# EAGLE board cblockyeeshok (EAGLE 6.6.0), part 1 of 2
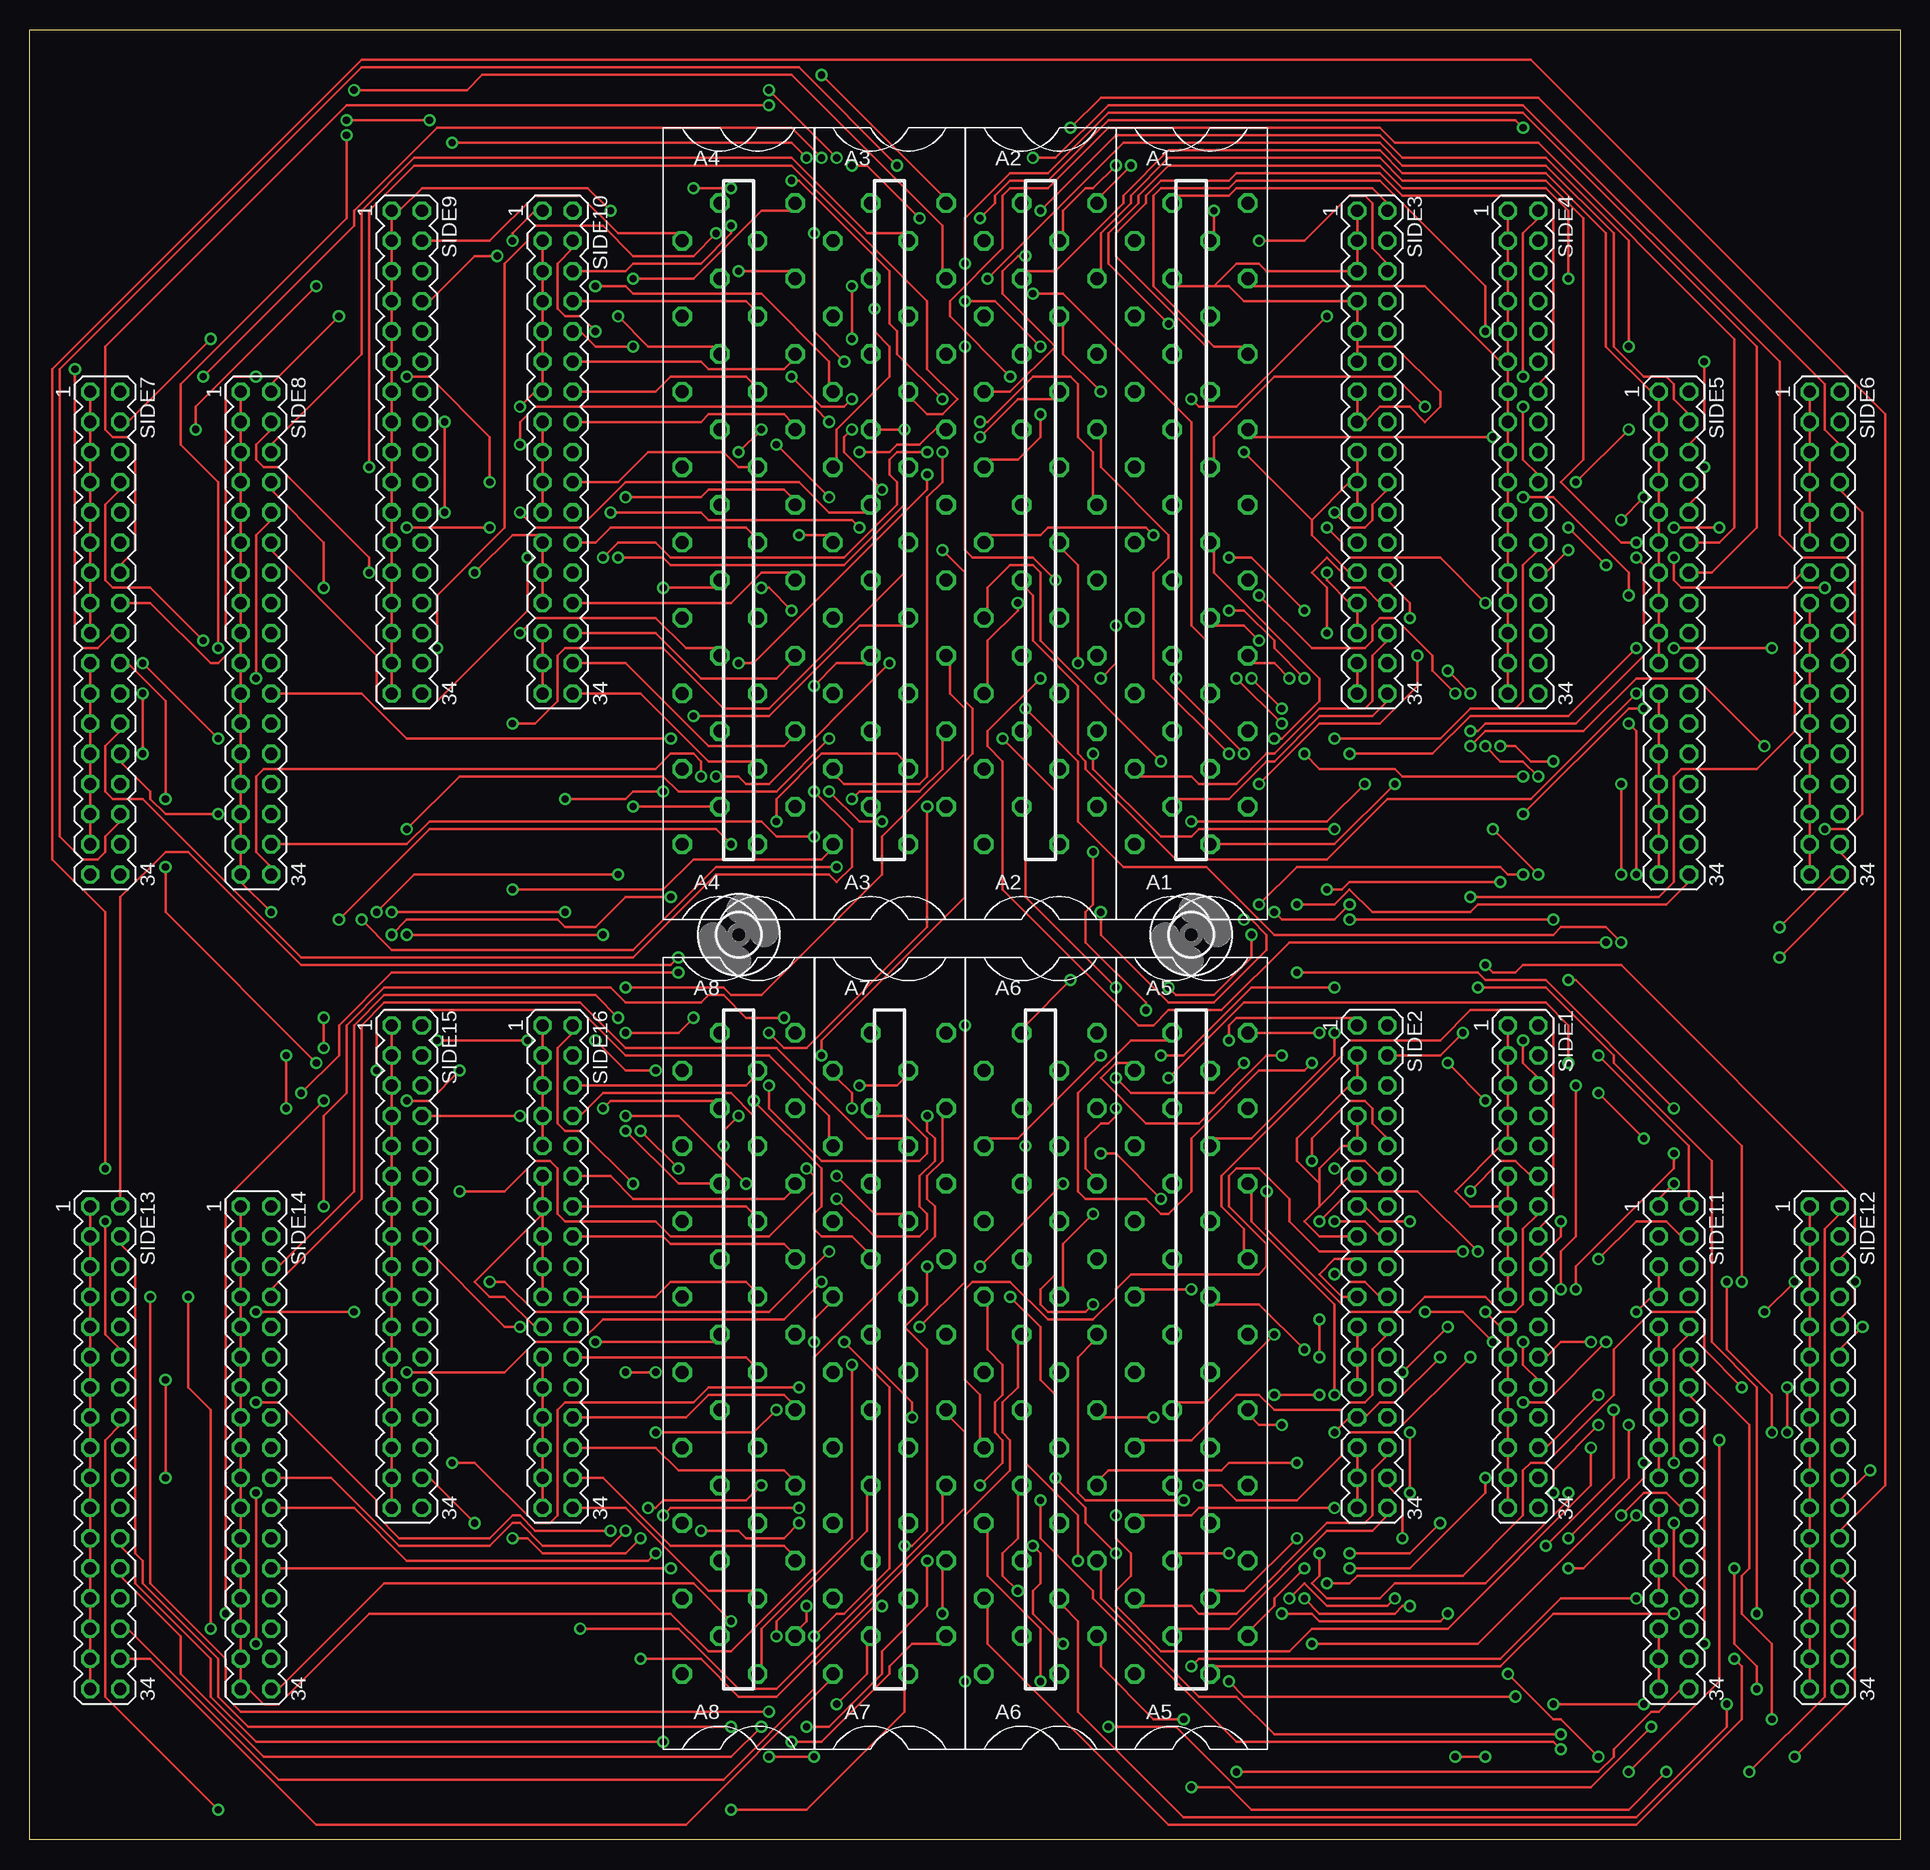
[diagram p1: board, top side]
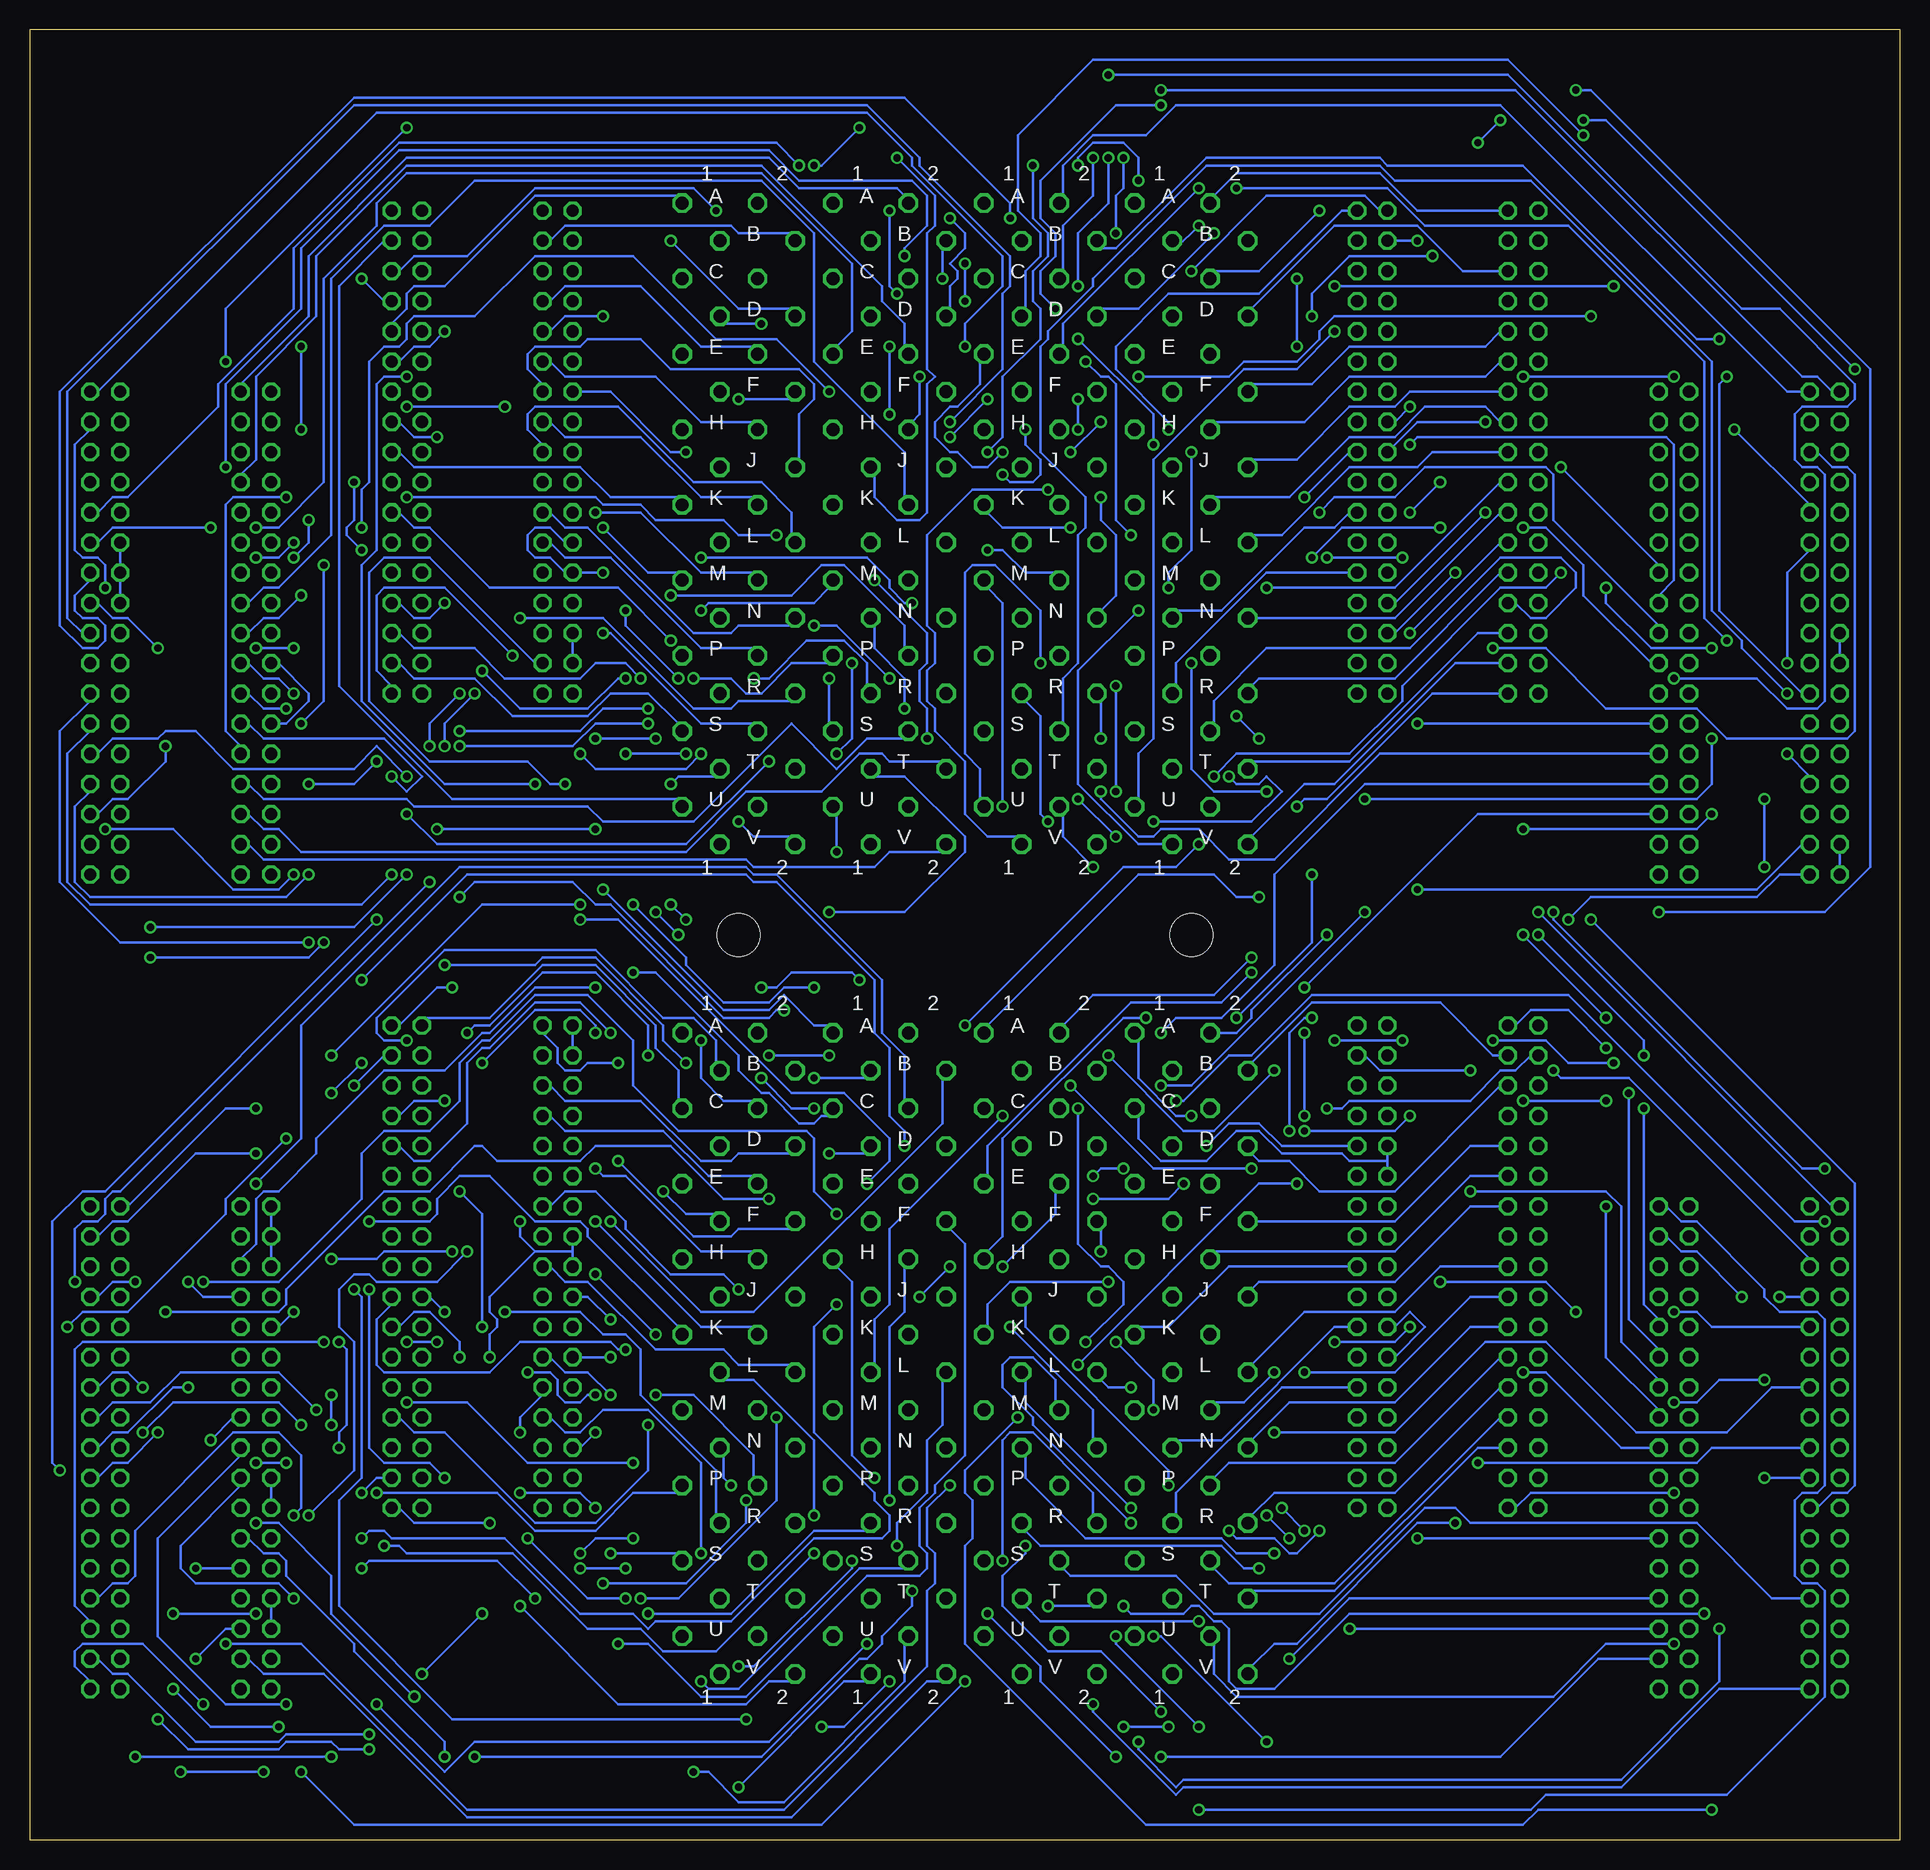
[diagram p2: board, bottom side, seen from below]

Size 157.48 x 152.4 mm. Coordinates in mm from the lower left corner, seen from the top.
Outline: 157.48,0 0,0 0,152.4 157.48,152.4 157.48,0
Copper layers (1*16): Top 0.035mm / dielectric 1.5mm / Bottom 0.035mm
Design rules "olimex8mil": minimum track width 8mil, minimum drill 24mil, track to track 8mil, track to pad 8mil, pad to pad 8mil, via to via 8mil, smd to smd 8mil, copper to edge 40mil, drill to drill 10mil, minimum pad ring 10mil, minimum via ring 8mil, stop-mask expansion 0mil, vias tented up to drill 0mil, thermal gap 10mil
Net classes: 1 Power: width 0.305 mm, clearance 0.305 mm

## Footprints (pad centres in the part's own frame; a part is rotated, then mirrored left to right if it is on the bottom)
H807 = drill 1.092 octagon: A1 4.763,28.575; A2 -1.587,28.575; B1 1.587,25.4; B2 -4.763,25.4; C1 4.763,22.225; C2 -1.587,22.225; D1 1.587,19.05; D2 -4.763,19.05; E1 4.763,15.875; E2 -1.587,15.875; F1 1.587,12.7; F2 -4.763,12.7; H1 4.763,9.525; H2 -1.587,9.525; J1 1.587,6.35; J2 -4.763,6.35; K1 4.763,3.175; K2 -1.587,3.175; L1 1.587,0; L2 -4.763,0; M1 4.763,-3.175; M2 -1.587,-3.175; N1 1.587,-6.35; N2 -4.763,-6.35; P1 4.763,-9.525; P2 -1.587,-9.525; R1 1.587,-12.7; R2 -4.763,-12.7; S1 4.763,-15.875; S2 -1.587,-15.875; T1 1.587,-19.05; T2 -4.763,-19.05; U1 4.763,-22.225; U2 -1.587,-22.225; V1 1.587,-25.4; V2 -4.763,-25.4
MA17-2 = drill 1.016 octagon: 1 -20.32,-1.27; 2 -20.32,1.27; 3 -17.78,-1.27; 4 -17.78,1.27; 5 -15.24,-1.27; 6 -15.24,1.27; 7 -12.7,-1.27; 8 -12.7,1.27; 9 -10.16,-1.27; 10 -10.16,1.27; 11 -7.62,-1.27; 12 -7.62,1.27; 13 -5.08,-1.27; 14 -5.08,1.27; 15 -2.54,-1.27; 16 -2.54,1.27; 17 0,-1.27; 18 0,1.27; 19 2.54,-1.27; 20 2.54,1.27; 21 5.08,-1.27; 22 5.08,1.27; 23 7.62,-1.27; 24 7.62,1.27; 25 10.16,-1.27; 26 10.16,1.27; 27 12.7,-1.27; 28 12.7,1.27; 29 15.24,-1.27; 30 15.24,1.27; 31 17.78,-1.27; 32 17.78,1.27; 33 20.32,-1.27; 34 20.32,1.27
3,6 = hole 3.6: 0,0

## Placement (x,y rotation side)
A1  [H807]  97.79,109.22 0 top
A2  [H807]  85.09,109.22 0 top
A3  [H807]  72.39,109.22 0 top
A4  [H807]  59.69,109.22 0 top
A5  [H807]  97.79,39.37 0 top
A6  [H807]  85.09,39.37 0 top
A7  [H807]  72.39,39.37 0 top
A8  [H807]  59.69,39.37 0 top
SIDE1  [MA17-2]  125.73,48.26 270 top
SIDE2  [MA17-2]  113.03,48.26 270 top
SIDE3  [MA17-2]  113.03,116.84 270 top
SIDE4  [MA17-2]  125.73,116.84 270 top
SIDE5  [MA17-2]  138.43,101.6 270 top
SIDE6  [MA17-2]  151.13,101.6 270 top
SIDE7  [MA17-2]  6.35,101.6 270 top
SIDE8  [MA17-2]  19.05,101.6 270 top
SIDE9  [MA17-2]  31.75,116.84 270 top
SIDE10  [MA17-2]  44.45,116.84 270 top
SIDE11  [MA17-2]  138.43,33.02 270 top
SIDE12  [MA17-2]  151.13,33.02 270 top
SIDE13  [MA17-2]  6.35,33.02 270 top
SIDE14  [MA17-2]  19.05,33.02 270 top
SIDE15  [MA17-2]  31.75,48.26 270 top
SIDE16  [MA17-2]  44.45,48.26 270 top
U$5  [3,6]  59.69,76.2 0 top
U$6  [3,6]  97.79,76.2 0 top

## Tracks (layer width: path | path; a pad name or v marks a point on that pad's centre or on a via)
N$1  (via drill 0.61)
  Top 0.203: SIDE2.3 111.76,65.41 111.76,64.14 SIDE2.5 111.12,63.5 106.68,59.05 106.68,57.15 108.58,55.24 | v100.97,67.31 100.97,68.58 101.6,69.22 111.76,69.22 SIDE2.1 | SIDE2.33 111.76,28.57 111.76,29.84 SIDE2.31 111.76,31.11 111.76,32.38 SIDE2.29 | v109.86,34.29 111.12,35.56 SIDE2.27 112.39,35.56 113.67,36.83 114.94,36.83 v118.75,40.64 | SIDE2.25 111.76,38.73 111.76,40.01 SIDE2.23 111.76,41.27 111.76,42.55 SIDE2.21 | SIDE2.7 111.76,60.33 111.76,59.05 SIDE2.9 111.12,58.42 110.49,58.42 108.58,56.52 108.58,55.24 | SIDE2.19 111.12,45.72 110.49,45.72 108.58,47.62 109.86,48.9 111.76,48.9 SIDE2.17 | v116.2,52.07 113.67,52.07 112.39,53.34 SIDE2.13 | 108.58,53.34 107.31,52.07 108.58,50.8 111.12,50.8 SIDE2.15 | 108.58,53.34 111.12,55.88 SIDE2.11 | 108.58,53.34 108.58,55.24 | v108.58,43.81 v108.58,40.64
  Bottom 0.203: v100.97,67.31 100.97,64.14 99.06,62.23 96.52,62.23 A5.C2 | SIDE2.3 111.76,66.67 111.76,67.94 SIDE2.1 | v109.86,34.29 111.12,33.02 SIDE2.29 | 111.76,49.53 111.76,48.9 SIDE2.17 | 111.76,49.53 111.76,50.16 SIDE2.15 | v116.2,52.07 116.2,50.8 114.94,49.53 | 114.94,49.53 111.76,49.53 | v108.58,40.64 111.12,40.64 SIDE2.23 | v108.58,43.81 110.49,45.72 111.12,45.72 SIDE2.19 | v118.75,40.64 118.75,42.55 118.11,43.18 118.11,43.81 118.75,44.45 118.75,45.72 114.94,49.53
N$2  (via drill 0.61)
  Top 0.203: v107.95,65.41 107.31,64.77 103.5,64.77 97.79,59.05 97.79,54.61 95.89,52.7 95.25,52.7 93.98,53.98 88.9,53.98 88.27,54.61 88.27,62.87 92.71,67.31 95.89,67.31 A5.A2
  Bottom 0.203: v107.95,65.41 110.49,65.41 111.12,64.77 112.39,64.77 113.03,65.41 113.03,66.67 114.3,67.94 SIDE2.2
N$3  (via drill 0.61)
  Top 0.203: v105.41,66.04 104.14,66.04 98.42,60.33 93.98,60.33 90.17,64.14 91.44,65.41 92.71,65.41 A5.B2 | v120.65,67.94 118.75,66.04 114.94,66.04 SIDE2.4
  Bottom 0.203: v105.41,66.04 105.41,68.58 109.86,73.03 114.3,73.03 118.75,68.58 120.02,68.58 v120.65,67.94
N$4
  Bottom 0.203: A5.D2 93.34,57.78 97.79,57.78 98.42,57.15 100.97,57.15 106.05,62.23 112.39,62.23 113.67,63.5 SIDE2.6
N$5
  Bottom 0.203: A5.E2 96.52,55.88 100.33,55.88 104.14,59.69 112.39,59.69 113.67,60.96 SIDE2.8
N$6  (via drill 0.61)
  Top 0.203: v107.95,57.15 107.95,59.05 111.12,62.23 112.39,62.23 113.03,61.59 113.03,60.33 114.3,59.05 SIDE2.10
  Bottom 0.203: v107.95,57.15 101.6,50.8 98.42,50.8 97.79,51.44 93.34,51.44 A5.F2
N$7  (via drill 0.61)
  Top 0.203: v109.86,56.52 110.49,56.52 111.12,57.15 112.39,57.15 113.67,55.88 SIDE2.12
  Bottom 0.203: v109.86,56.52 109.22,55.88 107.31,55.88 100.97,49.53 96.52,49.53 A5.H2
N$8  (via drill 0.61)
  Top 0.203: v97.79,46.35 93.34,46.35 A5.J2
  Bottom 0.203: v97.79,46.35 99.06,47.62 103.5,47.62 107.31,51.44 107.31,52.07 109.86,54.61 112.39,54.61 113.67,53.34 SIDE2.14
N$9  (via drill 0.61)
  Top 0.203: v109.86,52.07 112.39,52.07 113.67,50.8 SIDE2.16
  Bottom 0.203: v109.86,52.07 100.97,43.18 96.52,43.18 A5.K2
N$10
  Bottom 0.203: A5.L2 93.34,40.01 97.79,40.01 99.06,41.27 104.78,41.27 110.49,46.99 112.39,46.99 113.67,48.26 SIDE2.18
N$11  (via drill 0.61)
  Top 0.203: v104.78,42.55 99.06,36.83 96.52,36.83 A5.M2 | v109.86,47.62 110.49,47.62 111.12,46.99 112.39,46.99 113.67,45.72 SIDE2.20
  Bottom 0.203: v104.78,42.55 v109.86,47.62
N$12
  Top 0.203: A5.N2 93.34,33.66 97.79,33.66 101.6,37.47 103.5,37.47 104.78,36.2 110.49,36.2 111.12,36.83 112.39,36.83 113.03,37.47 113.03,41.27 114.3,42.55 SIDE2.22
N$13  (via drill 0.61)
  Top 0.203: v104.78,37.47 v108.58,37.47
  Bottom 0.203: v104.78,37.47 101.6,37.47 96.52,32.38 96.52,30.48 A5.P2 | v108.58,37.47 110.49,39.37 112.39,39.37 113.67,40.64 SIDE2.24
N$14  (via drill 0.61)
  Top 0.203: v109.86,27.94 98.42,27.94 97.79,27.3 93.34,27.3 A5.R2 | v116.2,29.21 v116.2,34.29
  Bottom 0.203: v109.86,27.94 111.12,29.21 v116.2,29.21 | v116.2,34.29 116.2,35.56 114.3,37.47 SIDE2.26
N$15  (via drill 0.61)
  Top 0.203: v100.97,24.13 96.52,24.13 A5.S2
  Bottom 0.203: v100.97,24.13 100.97,31.75 105.41,36.2 109.22,36.2 111.12,34.29 112.39,34.29 113.67,35.56 SIDE2.28
N$16
  Top 0.203: A5.T2 93.34,19.68 97.79,19.68 98.42,19.05 101.6,19.05 109.22,26.67 112.39,26.67 113.03,27.3 113.03,31.11 114.3,32.38 SIDE2.30
N$17
  Top 0.203: A5.U2 96.52,17.78 100.97,17.78 109.22,26.04 113.03,26.04 114.3,27.3 SIDE2.34
N$18  (via drill 0.61)
  Top 0.203: v116.2,19.68 115.57,19.68 114.94,19.05 108.58,19.05 v107.31,20.32 | v115.57,25.4 115.57,28.57 114.3,29.84 SIDE2.32
  Bottom 0.203: v116.2,19.68 107.95,11.43 97.16,11.43 95.25,13.34 93.34,13.34 A5.V2 | v107.31,20.32 110.49,20.32 v115.57,25.4
N$19  (via drill 0.61)
  Top 0.203: v108.58,67.94 102.87,67.94 A5.A1
  Bottom 0.203: v108.58,67.94 111.12,70.48 114.94,70.48 118.75,66.67 119.38,66.67 120.65,65.41 120.65,60.33 123.83,57.15 125.09,57.15 126.36,58.42 SIDE1.10
N$20  (via drill 0.61)
  Top 0.203: v125.73,67.31 125.73,65.41 127,64.14 SIDE1.6
  Bottom 0.203: v125.73,67.31 127.64,67.31 128.27,67.94 128.27,69.22 122.56,74.93 109.86,74.93 104.14,69.22 101.6,69.22 99.69,67.31 99.69,65.41 A5.B1
N$21  (via drill 0.61)
  Top 0.203: v109.86,67.94 109.86,66.04 102.87,59.05 99.69,59.05 A5.D1 | v119.38,65.41 v122.56,62.23
  Bottom 0.203: v109.86,67.94 109.86,68.58 111.12,69.85 114.94,69.85 v119.38,65.41 | v122.56,62.23 125.09,62.23 126.36,60.96 SIDE1.8
N$22  (via drill 0.61)
  Top 0.203: v109.86,37.47 109.86,45.09 102.87,52.07 102.87,54.61 A5.E1 | v115.57,39.37 v119.38,43.18 | v121.28,54.61 123.83,57.15 125.09,57.15 126.36,55.88 SIDE1.12
  Bottom 0.203: v109.86,37.47 110.49,37.47 111.12,36.83 112.39,36.83 113.03,37.47 113.03,38.73 113.67,39.37 v115.57,39.37 | v119.38,43.18 119.38,52.7 v121.28,54.61
N$23  (via drill 0.61)
  Top 0.203: v104.14,54.61 104.14,51.44 111.12,44.45 116.2,44.45 117.47,45.72 122.56,45.72 123.83,44.45 125.09,44.45 125.73,45.09 125.73,51.44 127,52.7 SIDE1.14
  Bottom 0.203: v104.14,54.61 102.23,52.7 99.69,52.7 A5.F1
N$24
  Top 0.203: A5.H1 102.23,49.53 102.23,51.44 100.33,53.34 100.33,55.88 110.49,66.04 110.49,66.67 111.12,67.31 118.75,67.31 121.28,69.85 127.64,69.85 128.27,69.22 128.27,52.7 127,51.44 SIDE1.16
N$25  (via drill 0.61)
  Top 0.203: v107.31,41.27 103.5,45.09 99.69,45.09 A5.J1
  Bottom 0.203: v107.31,41.27 107.95,41.27 108.58,41.91 116.2,41.91 118.75,39.37 127.64,39.37 128.27,40.01 128.27,43.81 127,45.09 SIDE1.20
N$26  (via drill 0.61)
  Top 0.203: v128.91,52.07 128.91,50.8 127,48.9 SIDE1.18
  Bottom 0.203: v128.91,52.07 123.83,52.07 123.19,52.7 123.19,53.98 121.28,55.88 118.75,55.88 114.94,52.07 111.12,52.07 110.49,51.44 110.49,50.8 102.87,43.18 A5.K1
N$27  (via drill 0.61)
  Top 0.203: v91.44,27.3 91.44,25.4 92.71,24.13 92.71,22.23 91.44,20.95 91.44,19.68 95.25,15.88 106.05,15.88 107.95,17.78 119.38,17.78 131.44,29.84 v131.44,33.02 | v131.44,41.91 128.91,41.91 127.64,40.64 SIDE1.24
  Bottom 0.203: v91.44,27.3 91.44,33.66 96.52,38.73 99.06,38.73 A5.L1 | v131.44,33.02 131.44,34.29 130.81,34.92 130.81,41.27 v131.44,41.91
N$28  (via drill 0.61)
  Top 0.203: v105.41,34.92 103.5,34.92 102.87,35.56 A5.M1
  Bottom 0.203: v105.41,34.92 105.41,31.11 109.86,26.67 114.94,26.67 122.56,34.29 125.09,34.29 126.36,35.56 SIDE1.28
N$29  (via drill 0.61)
  Top 0.203: v98.42,29.84 100.33,29.84 101.6,28.57 106.68,28.57 110.49,32.38 110.49,33.66 111.12,34.29 114.94,34.29 v121.28,40.64
  Bottom 0.203: v98.42,29.84 99.06,30.48 99.06,32.38 A5.N1 | v121.28,40.64 121.28,41.91 123.83,44.45 125.09,44.45 126.36,43.18 SIDE1.22
N$30  (via drill 0.61)
  Top 0.203: v128.27,29.21 128.27,31.11 v132.08,34.92 | v132.08,37.47 127.64,33.02 SIDE1.30
  Bottom 0.203: v128.27,29.21 118.11,29.21 114.94,26.04 109.86,26.04 106.68,29.21 102.87,29.21 A5.P1 | v132.08,34.92 v132.08,37.47
N$31  (via drill 0.61)
  Top 0.203: v117.47,44.45 120.65,44.45 v123.19,41.91 | v125.73,41.91 125.73,40.01 127,38.73 SIDE1.26
  Bottom 0.203: v117.47,44.45 111.12,44.45 109.22,42.55 107.31,42.55 106.05,41.27 106.05,37.47 99.69,31.11 99.69,27.3 A5.R1 | v123.19,41.91 v125.73,41.91
N$32  (via drill 0.61)
  Top 0.203: v108.58,24.13 108.58,22.23 107.95,21.59 109.22,20.32 113.67,20.32 114.94,21.59 122.56,21.59 129.54,28.57 v129.54,29.21
  Bottom 0.203: v108.58,24.13 102.87,24.13 A5.S1 | v129.54,29.21 128.27,30.48 127.64,30.48 SIDE1.32
N$33  (via drill 0.61)
  Top 0.203: v106.68,25.4 102.23,20.95 99.69,20.95 A5.T1 | v111.12,24.13 116.2,24.13 v118.75,26.67
  Bottom 0.203: v106.68,25.4 109.86,25.4 v111.12,24.13 | v118.75,26.67 125.09,26.67 126.36,27.94 SIDE1.34
N$34  (via drill 0.61)
  Top 0.203: v107.31,22.86 104.78,20.32 104.78,19.68 102.87,17.78 A5.U1 | v111.12,22.86 116.2,22.86 122.56,29.21 v122.56,30.48 | v128.91,46.35 128.91,49.53 130.18,50.8 v130.18,63.5
  Bottom 0.203: v107.31,22.86 v111.12,22.86 | v122.56,30.48 123.83,31.75 127.64,31.75 128.91,33.02 v128.91,46.35 | v130.18,63.5 127.64,66.04 SIDE1.4
N$35  (via drill 0.61)
  Top 0.203: v138.43,19.05 128.27,19.05 123.83,14.61 99.69,14.61 A5.V1 | v145.41,19.05 145.41,38.1 141.6,41.91 141.6,57.15 133.35,65.41 133.35,66.04 127.64,71.75 v121.92,71.75
  Bottom 0.203: v138.43,19.05 v145.41,19.05 | v121.92,71.75 123.19,71.75 126.36,68.58 SIDE1.2
N$36  (via drill 0.61)
  Top 0.203: SIDE1.33 124.46,28.57 124.46,29.84 SIDE1.31 124.46,31.11 124.46,32.38 SIDE1.29 124.46,33.66 124.46,34.92 SIDE1.27 124.46,36.2 124.46,37.47 SIDE1.25 124.46,38.73 124.46,40.01 SIDE1.23 124.46,41.27 124.46,42.55 SIDE1.21 123.83,43.18 v122.56,44.45 | SIDE1.19 124.46,46.35 124.46,47.62 SIDE1.17 124.46,48.9 124.46,50.16 SIDE1.15 124.46,51.44 124.46,52.7 SIDE1.13 | SIDE1.11 124.46,55.24 124.46,53.98 SIDE1.13 | SIDE1.1 124.46,67.94 124.46,66.67 SIDE1.3 124.46,65.41 124.46,64.14 SIDE1.5 124.46,62.87 124.46,61.59 SIDE1.7 124.46,60.33 124.46,59.05 SIDE1.9 123.83,58.42 120.02,54.61 121.28,53.34 123.83,53.34 SIDE1.13
  Bottom 0.203: A5.C1 102.87,62.23 102.87,64.77 104.78,66.67 104.78,68.58 109.86,73.66 114.3,73.66 118.75,69.22 124.46,69.22 SIDE1.1 | v122.56,44.45 123.83,45.72 SIDE1.19
N$37  (via drill 0.61)
  Top 0.203: SIDE3.33 111.76,97.16 111.76,98.42 SIDE3.31 | SIDE3.29 111.76,102.23 111.76,103.5 SIDE3.27 111.12,104.14 109.22,106.05 v109.22,106.68 | 107.95,111.12 107.95,109.86 111.12,106.68 SIDE3.25 | 107.95,111.12 111.12,114.3 SIDE3.19 | SIDE3.21 111.76,112.39 111.76,113.67 SIDE3.19 | SIDE3.17 111.76,116.2 111.76,114.94 SIDE3.19 | SIDE3.13 111.76,121.28 111.76,120.02 SIDE3.15 112.39,119.38 113.67,120.65 116.2,120.65 117.47,119.38 118.75,120.65 118.75,121.92 114.94,125.73 111.76,125.73 | 111.76,125.73 111.76,126.36 SIDE3.9 111.76,127.64 111.76,128.91 SIDE3.7 111.12,129.54 102.23,129.54 100.97,130.81 99.69,130.81 | 111.76,125.73 111.76,125.09 SIDE3.11 | SIDE3.1 111.76,136.53 111.76,135.25 SIDE3.3 111.76,133.99 111.76,132.72 SIDE3.5 111.12,132.08 104.14,132.08 103.5,132.72 101.6,132.72 99.69,130.81 | 99.69,130.81 96.52,130.81 A1.C2 | 107.95,111.12 v102.23,116.84
  Bottom 0.203: SIDE3.29 111.76,100.97 111.76,99.69 SIDE3.31 | SIDE3.23 112.39,109.22 113.67,110.49 114.94,110.49 115.57,109.86 115.57,108.58 114.94,107.95 113.67,107.95 112.39,106.68 SIDE3.25 111.12,106.68 v109.22,106.68 | v102.23,116.84 103.5,116.84 108.58,121.92 111.12,121.92 SIDE3.13
N$38
  Top 0.203: SIDE3.2 114.3,137.79 113.03,139.06 101.6,139.06 100.97,138.43 96.52,138.43 A1.A2
N$39
  Bottom 0.203: A1.B2 93.34,135.25 97.79,135.25 98.42,135.89 112.39,135.89 113.67,134.62 SIDE3.4
N$40  (via drill 0.61)
  Top 0.203: v103.5,134.62 107.31,134.62 111.12,138.43 112.39,138.43 113.03,137.79 113.03,133.99 114.3,132.72 SIDE3.6
  Bottom 0.203: v103.5,134.62 97.79,128.91 93.34,128.91 A1.D2
N$41
  Bottom 0.203: A1.E2 96.52,125.73 100.97,125.73 106.05,130.81 112.39,130.81 113.67,129.54 SIDE3.8
N$42  (via drill 0.61)
  Top 0.203: v97.79,121.28 98.42,120.65 101.6,120.65 v109.22,128.27
  Bottom 0.203: v97.79,121.28 93.34,121.28 A1.F2 | v109.22,128.27 112.39,128.27 113.67,127 SIDE3.10
N$43
  Bottom 0.203: A1.H2 96.52,119.38 100.97,119.38 104.78,123.19 112.39,123.19 113.67,124.46 SIDE3.12
N$44
  Bottom 0.203: A1.J2 92.71,116.2 92.71,120.02 91.44,121.28 91.44,122.56 92.71,123.83 103.5,123.83 106.05,126.36 110.49,126.36 111.12,125.73 114.94,125.73 115.57,125.09 115.57,123.83 114.3,122.56 SIDE3.14
N$45
  Bottom 0.203: A1.K2 96.52,113.03 100.97,113.03 106.05,118.11 112.39,118.11 113.67,119.38 SIDE3.16
N$46
  Bottom 0.203: A1.L2 93.34,109.86 93.34,111.76 95.89,114.3 101.6,114.3 107.95,120.65 114.94,120.65 115.57,120.02 115.57,118.75 114.3,117.47 SIDE3.18
N$47  (via drill 0.61)
  Top 0.203: v109.86,111.76 111.12,110.49 112.39,110.49 113.03,111.12 113.03,112.39 114.3,113.67 SIDE3.20
  Bottom 0.203: v109.86,111.76 106.05,111.76 100.97,106.68 96.52,106.68 A1.M2
N$48
  Bottom 0.203: A1.N2 93.34,102.23 97.79,102.23 98.42,101.6 101.6,101.6 110.49,110.49 112.39,110.49 113.67,111.76 SIDE3.22
N$49
  Bottom 0.203: A1.P2 96.52,100.33 100.97,100.33 108.58,107.95 112.39,107.95 113.67,109.22 SIDE3.24
N$50  (via drill 0.61)
  Top 0.203: v116.2,102.87 116.2,104.14 114.3,106.05 SIDE3.26
  Bottom 0.203: v116.2,102.87 109.22,102.87 101.6,95.25 98.42,95.25 97.79,95.89 93.34,95.89 A1.R2
N$51  (via drill 0.61)
  Top 0.203: v109.22,101.6 109.22,105.41 107.95,106.68 109.22,107.95 110.49,106.68 110.49,106.05 111.12,105.41 112.39,105.41 113.67,104.14 SIDE3.28
  Bottom 0.203: v109.22,101.6 108.58,101.6 100.97,93.98 96.52,93.98 A1.S2
N$52
  Top 0.203: A1.T2 93.34,89.53 97.79,89.53 98.42,88.9 101.6,88.9 104.14,91.44 104.78,91.44 108.58,95.25 112.39,95.25 113.03,95.89 113.03,99.69 114.3,100.97 SIDE3.30
N$53
  Top 0.203: A1.U2 96.52,87.63 100.97,87.63 104.14,90.81 104.78,90.81 108.58,94.61 113.03,94.61 114.3,95.89 SIDE3.34
N$54  (via drill 0.61)
  Top 0.203: v97.79,85.72 109.22,85.72 v112.39,88.9
  Bottom 0.203: v97.79,85.72 96.52,84.45 93.34,84.45 A1.V2 | v112.39,88.9 113.67,88.9 115.57,90.81 123.83,90.81 128.91,95.89 128.91,106.68 127.64,107.95 123.83,107.95 114.94,99.06 SIDE3.32
N$55
  Bottom 0.203: SIDE4.10 127,127.64 125.73,128.91 125.73,130.18 125.09,130.81 122.56,130.81 114.94,138.43 102.87,138.43 A1.A1
N$56  (via drill 0.61)
  Top 0.203: v99.69,137.16 99.69,135.25 A1.B1
  Bottom 0.203: v99.69,137.16 101.6,139.06 114.94,139.06 120.65,133.35 125.09,133.35 126.36,132.08 SIDE4.6
N$57  (via drill 0.61)
  Top 0.203: v95.89,127.64 90.81,132.72 90.81,135.25 93.34,137.79 93.34,138.43 95.89,140.97 113.67,140.97 115.57,139.06 127.64,139.06 129.54,137.16 v129.54,131.44
  Bottom 0.203: v95.89,127.64 99.06,127.64 A1.D1 | v129.54,131.44 127.64,129.54 SIDE4.8
N$58  (via drill 0.61)
  Top 0.203: v122.56,127 122.56,130.81 113.67,139.7 101.6,139.7 100.97,139.06 95.25,139.06 94.61,138.43 94.61,130.81 99.69,125.73 102.23,125.73 A1.E1
  Bottom 0.203: v122.56,127 123.83,125.73 125.09,125.73 126.36,124.46 SIDE4.12
N$59
  Top 0.203: A1.F1 99.06,122.56 99.06,125.73 91.44,133.35 91.44,135.25 93.98,137.79 93.98,138.43 95.25,139.7 100.97,139.7 101.6,140.34 113.67,140.34 115.57,138.43 127.64,138.43 128.27,137.79 128.27,123.83 127,122.56 SIDE4.14
N$60  (via drill 0.61)
  Top 0.203: v123.19,118.11 102.87,118.11 A1.H1
  Bottom 0.203: v123.19,118.11 125.09,118.11 126.36,119.38 SIDE4.16
N$61  (via drill 0.61)
  Top 0.203: v125.73,120.65 125.73,116.2 127,114.94 SIDE4.20 | v117.47,120.65 114.94,123.19 104.78,123.19 99.69,118.11 99.69,116.2 A1.J1
  Bottom 0.203: v117.47,120.65 v125.73,120.65
N$62
  Bottom 0.203: A1.K1 102.87,113.03 108.58,113.03 111.12,115.57 125.09,115.57 126.36,116.84 SIDE4.18
N$63  (via drill 0.61)
  Top 0.203: v104.78,92.71 105.41,92.71 108.58,95.89 108.58,97.79 99.69,106.68 99.69,108.58 A1.L1 | v109.86,92.71 118.75,92.71 121.28,95.25 125.09,95.25 125.73,95.89 125.73,107.31 127,108.58 SIDE4.24
  Bottom 0.203: v104.78,92.71 v109.86,92.71
N$64  (via drill 0.61)
  Top 0.203: v109.22,110.49 110.49,109.22 110.49,108.58 111.12,107.95 118.75,107.95 v122.56,104.14
  Bottom 0.203: v109.22,110.49 105.41,106.68 102.87,106.68 A1.M1 | v122.56,104.14 123.83,102.87 125.09,102.87 126.36,104.14 SIDE4.28
N$65  (via drill 0.61)
  Top 0.203: v103.5,100.97 102.23,102.23 99.69,102.23 A1.N1
  Bottom 0.203: v103.5,100.97 107.95,105.41 118.75,105.41 123.83,110.49 125.09,110.49 126.36,111.76 SIDE4.22
N$66  (via drill 0.61)
  Top 0.203: v106.05,97.79 104.78,99.06 102.87,99.06 A1.P1
  Bottom 0.203: v106.05,97.79 107.31,99.06 109.86,99.06 111.12,97.79 117.47,97.79 120.02,100.33 125.09,100.33 126.36,101.6 SIDE4.30
N$67  (via drill 0.61)
  Top 0.203: v84.45,130.18 87,130.18 97.79,119.38 97.79,102.23 99.06,100.97 99.06,97.16 A1.R1 | v85.09,137.16 91.44,143.51 113.67,143.51 115.57,141.6 127.64,141.6 134.62,134.62 v134.62,125.73 | v134.62,118.75 v130.18,114.3 | v129.54,108.58 127.64,106.68 SIDE4.26
  Bottom 0.203: v84.45,130.18 85.09,130.81 v85.09,137.16 | v134.62,125.73 v134.62,118.75 | v130.18,114.3 130.18,111.12 130.81,110.49 130.81,109.86 v129.54,108.58
N$68
  Bottom 0.203: A1.S1 102.87,93.98 105.41,96.52 108.58,96.52 110.49,94.61 116.84,94.61 120.02,97.79 125.09,97.79 126.36,99.06 SIDE4.32
N$69  (via drill 0.61)
  Top 0.203: v103.5,88.9 108.58,93.98 113.67,93.98 116.84,97.16 v116.84,99.69
  Bottom 0.203: v103.5,88.9 102.87,89.53 99.69,89.53 A1.T1 | v116.84,99.69 122.56,105.41 127.64,105.41 128.27,104.78 128.27,98.42 127,97.16 SIDE4.34
N$70
  Bottom 0.203: A1.U1 102.87,87.63 121.92,87.63 131.44,97.16 131.44,130.81 127.64,134.62 SIDE4.4
N$71  (via drill 0.61)
  Top 0.203: v114.94,88.9 109.86,83.82 99.69,83.82 A1.V1 | v125.73,123.19 125.73,135.25 127,136.53 SIDE4.2
  Bottom 0.203: v114.94,88.9 122.56,88.9 129.54,95.89 129.54,107.31 128.27,108.58 128.27,122.56 127.64,123.19 v125.73,123.19
N$72
  Top 0.203: SIDE4.33 124.46,97.16 124.46,98.42 SIDE4.31 124.46,99.69 124.46,100.97 SIDE4.29 124.46,102.23 124.46,103.5 SIDE4.27 124.46,104.78 124.46,106.05 SIDE4.25 124.46,107.31 124.46,108.58 SIDE4.23 124.46,109.86 124.46,111.12 SIDE4.21 124.46,112.39 124.46,113.67 SIDE4.19 124.46,114.94 124.46,116.2 SIDE4.17 124.46,117.47 124.46,118.75 SIDE4.15 124.46,120.02 124.46,121.28 SIDE4.13 124.46,122.56 124.46,123.83 SIDE4.11 | SIDE4.11 124.46,125.09 124.46,126.36 SIDE4.9 124.46,127.64 124.46,128.91 SIDE4.7 124.46,130.18 124.46,131.44 SIDE4.5 124.46,132.72 124.46,133.99 SIDE4.3 124.46,135.25 124.46,136.53 SIDE4.1 | A1.C1 102.87,130.81 117.47,130.81 123.83,124.46 SIDE4.11
N$73
  Top 0.203: SIDE5.33 137.16,81.92 137.16,83.19 SIDE5.31 137.16,84.45 137.16,85.72 SIDE5.29 137.16,87 137.16,88.27 SIDE5.27 137.16,89.53 137.16,90.81 SIDE5.25 137.16,92.08 137.16,93.34 SIDE5.23 137.16,94.61 137.16,95.89 SIDE5.21 | SIDE5.19 137.16,99.69 137.16,100.97 SIDE5.17 137.16,102.23 137.16,103.5 SIDE5.15 137.16,104.78 137.16,106.05 SIDE5.13 137.16,107.31 137.16,108.58 SIDE5.11 137.16,109.86 137.16,111.12 SIDE5.9 137.16,112.39 137.16,113.67 SIDE5.7 137.16,114.94 137.16,116.2 SIDE5.5 137.16,117.47 137.16,118.75 SIDE5.3 137.16,120.02 137.16,121.28 SIDE5.1 136.53,121.92 132.72,125.73 132.72,135.25 127.64,140.34 115.57,140.34 113.67,142.24 95.89,142.24 92.08,138.43 92.08,137.79 86.36,132.08 83.82,132.08 A2.C2
  Bottom 0.203: SIDE5.23 136.53,93.98 135.89,93.98 133.99,95.89 133.99,96.52 136.53,99.06 SIDE5.19
N$74
  Bottom 0.203: SIDE5.2 139.7,122.56 133.99,128.27 133.99,133.35 125.73,141.6 95.25,141.6 92.71,139.06 84.45,139.06 83.82,138.43 A2.A2
N$75  (via drill 0.61)
  Top 0.203: v80.64,131.44 92.08,142.88 113.67,142.88 115.57,140.97 127.64,140.97 133.35,135.25 133.35,125.73 135.89,123.19 137.79,123.19 138.43,122.56 138.43,121.28 139.7,120.02 SIDE5.4
  Bottom 0.203: v80.64,131.44 80.64,133.99 A2.B2
N$76  (via drill 0.61)
  Top 0.203: v80.01,136.53 81.28,137.79 81.28,138.43 82.55,139.7 85.72,139.7 90.81,144.78 125.09,144.78 v125.73,144.15 | v140.97,124.46 140.97,118.75 139.7,117.47 SIDE5.6
  Bottom 0.203: v80.01,136.53 78.74,135.25 78.74,133.99 80.01,132.72 79.38,132.08 79.38,131.44 80.01,130.81 80.01,128.91 A2.D2 | v125.73,144.15 140.97,128.91 v140.97,124.46
N$77
  Bottom 0.203: SIDE5.8 139.7,114.94 138.43,116.2 138.43,123.19 133.35,128.27 133.35,133.35 125.73,140.97 95.89,140.97 85.72,130.81 85.72,129.54 83.82,127.64 83.82,125.73 A2.E2
N$78  (via drill 0.61)
  Top 0.203: v140.97,115.57 140.97,113.67 139.7,112.39 SIDE5.10 | v83.82,133.35 83.19,133.35 81.92,132.08 81.92,130.18 86.36,125.73 82.55,121.92 80.64,121.92 A2.F2
  Bottom 0.203: v140.97,115.57 140.97,122.56 134.62,128.91 134.62,133.99 126.36,142.24 95.25,142.24 92.71,139.7 83.19,139.7 81.92,138.43 81.92,135.89 83.82,133.99 v83.82,133.35
N$79  (via drill 0.61)
  Top 0.203: v82.55,123.19 77.47,128.27 77.47,129.54 81.92,133.99 81.92,138.43 82.55,139.06 85.72,139.06 90.81,144.15 113.67,144.15 114.94,142.88 127,142.88 143.51,126.36 143.51,110.49 142.24,109.22 140.34,109.22 SIDE5.12
  Bottom 0.203: v82.55,123.19 82.55,120.02 83.19,119.38 A2.H2
N$80  (via drill 0.61)
  Top 0.203: v85.09,120.02 85.09,118.11 83.19,116.2 80.64,116.2 A2.J2 | v85.09,125.73 81.28,129.54 v78.74,129.54 | v78.74,132.72 78.74,136.53 82.55,140.34 85.72,140.34 90.81,145.41 125.73,145.41 145.41,125.73 145.41,110.49 141.6,106.68 140.34,106.68 SIDE5.14
  Bottom 0.203: v85.09,125.73 v85.09,120.02 | v78.74,132.72 v78.74,129.54
N$81
  Bottom 0.203: A2.K2 83.82,113.03 83.82,116.84 91.44,124.46 91.44,135.25 95.89,139.7 120.02,139.7 123.83,135.89 127.64,135.89 132.08,131.44 132.08,109.86 136.53,105.41 137.79,105.41 139.06,104.14 SIDE5.16
N$82  (via drill 0.61)
  Top 0.203: v94.61,109.86 93.98,110.49 85.72,110.49 85.09,109.86 80.64,109.86 A2.L2 | v125.73,113.03 128.27,113.03 134.62,106.68 v134.62,104.78
  Bottom 0.203: v94.61,109.86 97.79,109.86 99.06,111.12 104.78,111.12 106.05,112.39 109.22,112.39 109.86,113.03 v125.73,113.03 | v134.62,104.78 136.53,102.87 137.79,102.87 139.06,101.6 SIDE5.18
N$83  (via drill 0.61)
  Top 0.203: v135.25,96.52 126.36,87.63 114.3,87.63 109.22,82.55 96.52,82.55 88.9,90.17 88.9,90.81 88.27,91.44 88.27,97.16 84.45,100.97 84.45,104.78 83.82,105.41 A2.M2
  Bottom 0.203: v135.25,96.52 136.53,97.79 137.79,97.79 139.06,99.06 SIDE5.20
N$84  (via drill 0.61)
  Top 0.203: v95.25,90.81 85.09,100.97 85.09,106.68 84.45,107.31 82.55,107.31 80.64,105.41 80.64,103.5 A2.N2 | v125.73,86.36 134.62,95.25 v135.89,95.25
  Bottom 0.203: v95.25,90.81 102.23,83.82 123.19,83.82 v125.73,86.36 | v135.89,95.25 137.79,95.25 139.06,96.52 SIDE5.22
N$85  (via drill 0.61)
  Top 0.203: v127,89.53 125.73,90.81 123.83,90.81 v122.56,92.08 | v120.02,96.52 118.11,98.42 118.11,99.69 114.94,102.87 113.67,102.87 113.03,102.23 113.03,100.97 112.39,100.33 107.95,100.33 v103.5,104.78
  Bottom 0.203: v127,89.53 125.73,88.27 124.46,89.53 127.64,92.71 137.79,92.71 139.06,93.98 SIDE5.24 | v122.56,92.08 122.56,93.98 v120.02,96.52 | v103.5,104.78 93.34,104.78 90.81,107.31 88.9,107.31 83.82,102.23 83.82,100.33 A2.P2
N$86  (via drill 0.61)
  Top 0.203: v83.19,104.14 83.19,103.5 80.64,100.97 80.64,97.16 A2.R2 | v100.97,107.95 102.87,107.95 v107.31,103.5 | v102.87,97.79 v105.41,95.25 | v121.28,93.34 121.92,93.34 122.56,93.98 130.18,93.98 136.53,100.33 135.89,100.97 135.89,107.31 v135.25,107.95 | v133.99,111.12 v135.89,113.03
  Bottom 0.203: v83.19,104.14 83.82,104.14 85.09,105.41 85.09,106.05 87,107.95 v100.97,107.95 | v107.31,103.5 107.31,102.23 v102.87,97.79 | v105.41,95.25 109.22,95.25 111.12,93.34 v121.28,93.34 | v135.25,107.95 133.99,109.22 v133.99,111.12 | v135.89,113.03 140.34,113.03 140.97,112.39 140.97,93.34 139.7,92.08 SIDE5.26
N$87
  Bottom 0.203: A2.S2 83.82,92.71 87,92.71 89.53,90.17 93.34,93.98 101.6,85.72 109.22,85.72 110.49,87 125.09,87 125.73,87.63 137.79,87.63 139.06,88.9 SIDE5.28
N$88
  Bottom 0.203: A2.T2 80.64,90.81 85.09,90.81 85.72,91.44 87.63,91.44 90.81,88.27 97.16,88.27 102.23,83.19 134.62,83.19 136.53,85.09 137.79,85.09 139.06,86.36 SIDE5.30
N$89  (via drill 0.61)
  Top 0.203: v106.68,78.74 109.86,78.74 111.12,80.01 113.03,78.11 121.28,78.11 121.92,78.74 137.79,78.74 139.7,80.64 SIDE5.34 | v91.44,71.75 83.82,79.38 83.82,86.36 A2.U2
  Bottom 0.203: v106.68,78.74 102.23,74.3 102.23,73.66 99.06,70.48 95.25,70.48 93.98,71.75 v91.44,71.75
N$90
  Bottom 0.203: A2.V2 80.64,83.19 85.09,83.19 86.36,81.92 96.52,81.92 97.16,82.55 137.79,82.55 139.06,83.82 SIDE5.32
N$91  (via drill 0.61)
  Top 0.203: v92.71,140.97 90.17,138.43 A2.A1
  Bottom 0.203: v92.71,140.97 94.61,142.88 126.36,142.88 135.25,133.99 135.25,128.91 141.6,122.56 141.6,120.65 149.22,113.03 150.5,113.03 151.76,111.76 SIDE6.10
N$92  (via drill 0.61)
  Top 0.203: v87.63,144.15 90.17,146.69 127,146.69 151.13,122.56 151.13,118.75 152.4,117.47 SIDE6.6 | v91.44,140.97 89.53,139.06 88.9,139.06 87,137.16 87,135.25 A2.B1
  Bottom 0.203: v87.63,144.15 90.81,140.97 v91.44,140.97
N$93  (via drill 0.61)
  Top 0.203: v151.13,85.09 153.03,85.09 154.31,86.36 154.31,111.76 152.4,113.67 SIDE6.8 | v135.25,81.28 135.25,93.34 v134.62,93.98 | v132.72,107.31 v129.54,110.49 | v90.17,121.92 87,125.09 87,127.64 A2.D1
  Bottom 0.203: v151.13,85.09 145.41,85.09 140.34,80.01 136.53,80.01 v135.25,81.28 | v134.62,93.98 132.72,95.89 v132.72,107.31 | v129.54,110.49 129.54,113.67 128.91,114.3 128.91,124.46 127.64,125.73 126.36,125.73 125.73,126.36 125.73,127.64 125.09,128.27 120.02,128.27 114.94,133.35 106.68,133.35 99.69,126.36 94.61,126.36 v90.17,121.92
N$94  (via drill 0.61)
  Top 0.203: v142.24,110.49 v138.43,110.49
  Bottom 0.203: v142.24,110.49 150.5,110.49 151.76,109.22 SIDE6.12 | v138.43,110.49 136.53,110.49 132.72,114.3 132.72,131.44 128.27,135.89 128.27,137.79 125.73,140.34 95.89,140.34 88.27,132.72 88.27,127 89.53,125.73 A2.E1
N$95  (via drill 0.61)
  Top 0.203: v80.01,118.11 83.19,121.28 86.36,121.28 A2.F1 | v76.83,121.28 73.03,125.09 73.03,127 72.39,127.64 72.39,132.08 64.77,139.7 v64.14,139.7 | v69.22,140.97 70.48,140.97 v74.93,136.53
  Bottom 0.203: v76.83,121.28 v80.01,118.11 | v64.14,139.7 64.14,141.6 65.41,142.88 67.94,142.88 69.22,141.6 v69.22,140.97 | v74.93,136.53 74.93,137.79 83.82,146.69 130.18,146.69 154.94,121.92 154.94,102.23 153.03,100.33 151.76,100.33 151.13,100.97 151.13,102.23 151.76,102.87 153.03,102.87 153.67,103.5 153.67,104.78 152.4,106.05 SIDE6.14
N$96  (via drill 0.61)
  Top 0.203: v100.97,91.44 94.61,97.79 94.61,106.68 95.89,107.95 95.89,109.86 90.17,115.57 90.17,118.11 A2.H1 | v111.12,91.44 118.11,91.44 121.28,94.61 129.54,94.61 v135.25,100.33 | v146.69,100.33 v138.43,100.33
  Bottom 0.203: v100.97,91.44 102.23,90.17 109.86,90.17 v111.12,91.44 | v138.43,100.33 v135.25,100.33 | v146.69,100.33 149.22,102.87 150.5,102.87 151.76,104.14 SIDE6.16
N$97  (via drill 0.61)
  Top 0.203: v84.45,141.6 86.36,141.6 90.81,146.05 125.73,146.05 147.32,124.46 147.32,109.86 149.22,107.95 153.03,107.95 153.67,107.31 153.67,100.97 152.4,99.69 SIDE6.20
  Bottom 0.203: v84.45,141.6 81.28,138.43 81.28,135.89 81.92,135.25 81.92,123.83 81.28,123.19 81.92,122.56 81.92,111.76 82.55,111.12 84.45,111.12 86.36,113.03 86.36,114.94 A2.J1
N$98  (via drill 0.61)
  Top 0.203: v80.01,119.38 80.64,119.38 84.45,123.19 87.63,123.19 88.27,122.56 88.27,118.11 89.53,116.84 89.53,113.03 A2.K1
  Bottom 0.203: v80.01,119.38 75.56,123.83 75.56,130.18 74.93,130.81 74.93,133.35 82.55,140.97 82.55,141.6 87,146.05 130.18,146.05 154.31,121.92 154.31,102.87 153.03,101.6 SIDE6.18
N$99  (via drill 0.61)
  Top 0.203: v123.19,85.09 v127,81.28 | v109.86,85.09 98.42,85.09 97.79,84.45 95.25,84.45 89.53,90.17 v89.53,91.44 | v88.27,99.06 88.27,107.31 87,108.58 A2.L1
  Bottom 0.203: v127,81.28 129.54,78.74 152.4,78.74 154.31,80.64 154.31,91.44 152.4,93.34 SIDE6.24 | v109.86,85.09 v123.19,85.09 | v89.53,91.44 88.27,92.71 v88.27,99.06
N$100  (via drill 0.61)
  Top 0.203: v133.99,88.9 v133.99,81.28 | v128.27,90.81 126.36,90.81 125.09,92.08 v123.83,92.08 | v119.38,98.42 v121.28,96.52 | v107.31,97.79 104.78,100.33 104.78,100.97 102.23,103.5 v100.97,103.5
  Bottom 0.203: v133.99,81.28 135.89,79.38 152.4,79.38 153.67,80.64 153.67,87 152.4,88.27 SIDE6.28 | v133.99,88.9 130.18,88.9 v128.27,90.81 | v123.83,92.08 123.83,93.98 v121.28,96.52 | v119.38,98.42 116.2,95.25 110.49,95.25 107.95,97.79 v107.31,97.79 | v100.97,103.5 100.33,104.14 91.44,104.14 90.17,105.41 A2.M1
N$101  (via drill 0.61)
  Top 0.203: v133.99,75.56 132.72,76.83 128.91,76.83 128.27,76.2 104.78,76.2 99.06,81.92 92.08,81.92 88.27,85.72 88.27,90.81 v83.82,95.25
  Bottom 0.203: v133.99,75.56 149.86,75.56 154.94,80.64 154.94,93.34 152.4,95.89 SIDE6.22 | v83.82,95.25 83.82,97.79 86.36,100.33 86.36,102.23 A2.N1
N$102  (via drill 0.61)
  Top 0.203: v101.6,97.79 v105.41,93.98 | v121.28,92.08 122.56,93.34 130.81,93.34 135.25,97.79 140.34,97.79 v146.05,92.08
  Bottom 0.203: v101.6,97.79 98.42,97.79 97.16,96.52 95.89,96.52 93.34,99.06 90.17,99.06 A2.P1 | v105.41,93.98 109.86,93.98 111.76,92.08 v121.28,92.08 | v146.05,92.08 146.05,90.81 149.22,87.63 150.5,87.63 151.76,86.36 SIDE6.30
N$103  (via drill 0.61)
  Top 0.203: v125.73,89.53 115.57,89.53 114.94,90.17 108.58,90.17 v107.31,91.44 | v102.23,91.44 96.52,97.16 v96.52,97.79
  Bottom 0.203: v125.73,89.53 128.27,92.08 130.18,90.17 140.34,90.17 143.51,93.34 146.05,93.34 146.69,92.71 150.5,92.71 151.76,91.44 SIDE6.26 | v102.23,91.44 v107.31,91.44 | v96.52,97.79 95.25,97.79 92.08,100.97 88.9,100.97 87,99.06 87,97.16 A2.R1
N$104  (via drill 0.61)
  Top 0.203: v90.17,97.79 91.44,99.06 v91.44,102.23 | v85.09,97.79 80.64,93.34 80.64,92.08 81.92,90.81 81.92,80.01 93.34,68.58 94.61,68.58 95.89,69.85 100.33,69.85 106.05,75.56 v132.72,75.56 | v147.32,74.3 153.67,80.64 153.67,81.92 152.4,83.19 SIDE6.32
  Bottom 0.203: v90.17,97.79 90.17,93.98 A2.S1 | v91.44,102.23 89.53,102.23 v85.09,97.79 | v132.72,75.56 133.99,74.3 v147.32,74.3
N$105  (via drill 0.61)
  Top 0.203: v147.32,76.83 151.76,81.28 SIDE6.34 | v125.73,81.28 124.46,81.28 123.83,81.92 106.68,81.92 v103.5,78.74 | v102.23,77.47 102.87,77.47 104.14,76.2 104.14,74.93 99.69,70.48 95.89,70.48 90.17,76.2 v90.17,78.11
  Bottom 0.203: v147.32,76.83 130.18,76.83 v125.73,81.28 | v102.23,77.47 v103.5,78.74 | v90.17,78.11 83.82,78.11 78.74,83.19 78.74,84.45 83.82,89.53 86.36,89.53 A2.T1
N$106  (via drill 0.61)
  Top 0.203: v89.53,83.19 89.53,78.74 88.9,78.11 88.9,75.56 93.98,70.48 v93.98,69.85 | v121.28,79.38 137.16,79.38 138.43,80.64 138.43,89.53 139.06,90.17 145.41,90.17 148.59,93.34 148.59,104.78 149.22,105.41 v151.13,105.41
  Bottom 0.203: v89.53,83.19 89.53,86.36 A2.U1 | v93.98,69.85 94.61,69.85 95.25,69.22 99.06,69.22 108.58,78.74 109.86,78.74 111.76,80.64 120.02,80.64 v121.28,79.38 | v151.13,105.41 151.13,107.31 151.76,107.95 153.03,107.95 153.67,108.58 153.67,117.47 152.4,118.75 SIDE6.4
N$107  (via drill 0.61)
  Top 0.203: v81.92,92.71 86.36,88.27 86.36,84.45 A2.V1 | v86.36,106.05 84.45,107.95 79.38,107.95 78.74,108.58 v78.74,125.73
  Bottom 0.203: v81.92,92.71 81.92,95.25 82.55,95.89 82.55,98.42 81.92,99.06 81.92,101.6 v86.36,106.05 | v78.74,125.73 78.74,127.64 75.56,130.81 75.56,133.35 83.19,140.97 83.19,141.6 87,145.41 128.27,145.41 151.76,121.92 SIDE6.2
N$108  (via drill 0.61)
  Top 0.203: SIDE6.33 149.86,81.92 149.86,83.19 SIDE6.31 149.86,84.45 149.86,85.72 SIDE6.29 149.86,87 149.86,88.27 SIDE6.27 149.86,89.53 149.86,90.81 SIDE6.25 149.86,92.08 149.86,93.34 SIDE6.23 149.86,94.61 149.86,95.89 SIDE6.21 149.86,97.16 149.86,98.42 SIDE6.19 149.86,99.69 149.86,100.97 SIDE6.17 149.86,102.23 149.86,103.5 SIDE6.15 | v135.25,109.22 133.99,109.22 128.91,114.3 130.81,116.2 130.81,136.53 127.64,139.7 115.57,139.7 113.67,141.6 95.89,141.6 92.71,138.43 92.71,137.79 90.17,135.25 90.17,132.08 A2.C1 | v138.43,107.95 138.43,106.05 139.06,105.41 147.96,105.41 149.22,106.68 SIDE6.13 | SIDE6.11 149.86,109.86 149.86,111.12 SIDE6.9 149.86,112.39 149.86,113.67 SIDE6.7 149.86,114.94 149.86,116.2 SIDE6.5 149.86,117.47 149.86,118.75 SIDE6.3 149.86,120.02 149.86,121.28 SIDE6.1
  Bottom 0.203: SIDE6.15 149.86,104.78 149.86,106.05 SIDE6.13 149.86,107.31 149.86,108.58 SIDE6.11 | v135.25,109.22 136.53,107.95 v138.43,107.95
N$109  (via drill 0.61)
  Top 0.203: SIDE7.31 5.08,84.45 5.08,85.72 SIDE7.29 5.08,87 5.08,88.27 SIDE7.27 5.08,89.53 5.08,90.81 SIDE7.25 5.08,92.08 5.08,93.34 SIDE7.23 5.08,94.61 5.08,95.89 SIDE7.21 5.08,97.16 5.08,98.42 SIDE7.19 | SIDE7.17 5.08,102.23 5.08,103.5 SIDE7.15 5.08,104.78 5.08,106.05 SIDE7.13 5.08,107.31 5.08,108.58 SIDE7.11 5.08,109.86 5.08,111.12 SIDE7.9 5.08,112.39 5.08,113.67 SIDE7.7 5.08,114.94 5.08,116.2 SIDE7.5 5.08,117.47 5.08,118.75 SIDE7.3 5.08,120.02 5.08,121.28 SIDE7.1 | v62.23,147.32 v67.94,141.6
  Bottom 0.203: SIDE7.33 5.08,81.92 5.08,83.19 SIDE7.31 | SIDE7.17 5.08,100.97 5.08,99.69 SIDE7.19 | v67.94,141.6 67.94,138.43 70.48,135.89 70.48,132.08 A3.C2 | v62.23,147.32 32.38,147.32 8.26,123.19 6.99,123.19 5.71,121.92 SIDE7.1
N$110
  Bottom 0.203: SIDE7.2 8.26,121.92 9.53,121.92 33.66,146.05 60.96,146.05 63.5,143.51 67.94,143.51 70.48,140.97 70.48,138.43 A3.A2
N$111  (via drill 0.61)
  Top 0.203: v15.24,126.36 8.26,119.38 SIDE7.4
  Bottom 0.203: v15.24,126.36 17.14,126.36 31.75,140.97 43.18,140.97 43.81,141.6 58.42,141.6 66.04,133.99 67.31,133.99 A3.B2
N$112  (via drill 0.61)
  Top 0.203: v34.29,100.33 34.29,104.78 40.01,110.49 40.01,132.72 41.91,134.62 41.91,135.25 42.55,135.89 48.26,135.89 50.8,133.35 55.88,133.35 v57.78,135.25
  Bottom 0.203: v34.29,100.33 29.84,100.33 24.77,95.25 17.14,95.25 14.61,92.71 4.45,92.71 3.81,93.34 3.81,114.94 4.45,115.57 5.71,115.57 6.99,116.84 SIDE7.6 | v57.78,135.25 64.14,128.91 67.31,128.91 A3.D2
N$113  (via drill 0.61)
  Top 0.203: v14.61,100.97 10.16,105.41 6.99,105.41 6.35,106.05 6.35,112.39 7.62,113.67 SIDE7.8 | v55.88,139.06 v59.05,139.06
  Bottom 0.203: v14.61,100.97 16.51,102.87 16.51,124.46 27.94,135.89 40.01,135.89 43.18,139.06 v55.88,139.06 | v59.05,139.06 70.48,127.64 70.48,125.73 A3.E2
N$114  (via drill 0.61)
  Top 0.203: v13.97,118.75 13.97,120.65 v24.13,130.81 | v47.62,130.81 50.16,130.81 50.8,130.18 61.59,130.18 67.31,124.46 67.31,122.56 A3.F2
  Bottom 0.203: v13.97,118.75 7.62,112.39 SIDE7.10 | v24.13,130.81 v47.62,130.81
N$115  (via drill 0.61)
  Top 0.203: v15.88,92.71 v9.53,99.06 | v45.09,87.63 50.16,87.63 50.8,88.27 v53.34,88.27 | v59.69,99.06 60.96,99.06 75.56,113.67 v75.56,114.94 | v73.66,118.75 71.12,118.75 A3.H2
  Bottom 0.203: v9.53,99.06 9.53,106.68 7.62,108.58 SIDE7.12 | v15.88,92.71 15.88,88.9 17.14,87.63 v45.09,87.63 | v53.34,88.27 57.78,88.27 59.69,90.17 v59.69,99.06 | v75.56,114.94 74.93,114.3 73.03,114.3 72.39,114.94 72.39,116.2 73.66,117.47 v73.66,118.75
N$116  (via drill 0.61)
  Top 0.203: v62.23,146.05 26.67,146.05 6.35,125.73 6.35,118.75 6.99,118.11 8.26,118.11 8.89,117.47 8.89,108.58 7.62,107.31 SIDE7.14 | v71.12,128.91 71.12,127 72.39,125.73 72.39,123.19 67.94,118.75 67.94,116.2 A3.J2
  Bottom 0.203: v62.23,146.05 66.04,146.05 72.39,139.7 72.39,136.53 71.12,135.25 71.12,133.35 72.39,132.08 72.39,130.18 v71.12,128.91
N$117  (via drill 0.61)
  Top 0.203: v19.05,123.19 17.14,123.19 16.51,122.56 16.51,100.97 17.14,100.33 15.88,99.06 15.24,99.06 10.16,104.14 8.26,104.14 SIDE7.16 | v31.75,123.19 33.66,123.19 38.73,118.11 v38.73,114.3 | v41.27,111.76 42.55,110.49 46.35,110.49 50.16,114.3 64.77,114.3 67.31,111.76 70.48,111.76 A3.K2
  Bottom 0.203: v19.05,123.19 v31.75,123.19 | v38.73,114.3 v41.27,111.76
N$118  (via drill 0.61)
  Top 0.203: v3.81,123.83 3.81,100.97 4.45,100.33 5.71,100.33 6.99,101.6 SIDE7.18 | v26.67,144.78 v33.66,144.78 | v35.56,142.88 64.14,142.88 v65.41,141.6 | v66.04,135.25 66.04,127 v68.58,124.46 | v64.77,109.86 67.31,109.86 A3.L2
  Bottom 0.203: v3.81,123.83 24.77,144.78 v26.67,144.78 | v33.66,144.78 v35.56,142.88 | v65.41,141.6 65.41,139.06 66.04,138.43 v66.04,135.25 | v68.58,124.46 67.31,123.19 66.67,123.19 66.04,122.56 66.04,111.12 v64.77,109.86
N$119  (via drill 0.61)
  Top 0.203: v11.43,87.63 11.43,95.89 8.26,99.06 SIDE7.20 | v11.43,81.92 11.43,78.11 v24.13,65.41 | v34.29,67.31 v41.91,67.31 | v47.62,67.31 50.16,64.77 v52.7,64.77 | v66.67,66.04 66.67,67.31 78.74,79.38 78.74,90.81 79.38,91.44 79.38,95.25 78.74,95.89 78.74,106.68 v76.83,108.58
  Bottom 0.203: v11.43,81.92 v11.43,87.63 | v24.13,65.41 27.94,65.41 29.84,67.31 v34.29,67.31 | v41.91,67.31 v47.62,67.31 | v52.7,64.77 57.78,59.69 60.33,59.69 v66.67,66.04 | v76.83,108.58 75.56,108.58 73.66,106.68 71.12,106.68 A3.M2
N$120  (via drill 0.61)
  Top 0.203: v14.61,123.19 27.3,135.89 27.3,137.16 34.29,144.15 64.14,144.15 v66.67,141.6 | v69.22,130.81 v69.22,126.36 | v62.87,117.47 v67.31,113.03
  Bottom 0.203: v14.61,123.19 15.24,122.56 15.24,103.5 8.26,96.52 SIDE7.22 | v66.67,141.6 66.67,137.79 69.22,135.25 v69.22,130.81 | v69.22,126.36 62.87,120.02 v62.87,117.47 | v67.31,113.03 67.31,111.12 66.04,109.86 66.04,104.78 67.31,103.5 A3.N2
N$121  (via drill 0.61)
  Top 0.203: v66.04,88.27 69.22,85.09 69.22,81.92 67.94,80.64 67.31,81.28 57.78,81.28 50.8,74.3 22.86,74.3 9.53,87.63 6.99,87.63 6.35,88.27 6.35,92.08 7.62,93.34 SIDE7.24 | v66.04,97.16 67.94,99.06 70.48,99.06 A3.P2
  Bottom 0.203: v66.04,88.27 v66.04,97.16
N$122  (via drill 0.61)
  Top 0.203: v15.88,86.36 11.43,86.36 10.16,87.63 10.16,88.27 7.62,90.81 SIDE7.26 | v31.75,85.09 36.2,89.53 53.34,89.53 54.61,88.27 62.87,88.27 v67.31,92.71
  Bottom 0.203: v15.88,86.36 17.14,85.09 v31.75,85.09 | v67.31,92.71 67.31,95.89 A3.R2
N$123  (via drill 0.61)
  Top 0.203: v9.53,91.44 v9.53,96.52
  Bottom 0.203: v9.53,91.44 7.62,89.53 SIDE7.28 | v9.53,96.52 13.34,100.33 13.34,100.97 15.88,103.5 15.88,124.46 31.11,139.7 42.55,139.7 43.81,140.97 58.42,140.97 67.94,131.44 67.94,130.81 71.75,127 71.75,126.36 72.39,125.73 72.39,116.84 68.58,113.03 68.58,110.49 69.22,109.86 69.22,99.06 70.48,97.79 70.48,93.98 A3.S2
N$124  (via drill 0.61)
  Top 0.203: v73.03,140.97 64.77,149.22 27.94,149.22 2.54,123.83 2.54,84.45 4.45,82.55 5.71,82.55 6.35,83.19 6.35,84.45 7.62,85.72 SIDE7.30 | v76.83,116.84 76.83,114.3 75.56,113.03 75.56,89.53 74.93,88.9 68.58,88.9 67.94,89.53 A3.T2
  Bottom 0.203: v73.03,140.97 73.03,136.53 71.75,135.25 71.75,133.35 73.03,132.08 73.03,129.54 72.39,128.91 72.39,126.36 75.56,123.19 75.56,118.11 v76.83,116.84
N$125  (via drill 0.61)
  Top 0.203: v27.94,77.47 30.48,74.93 50.8,74.93 57.78,81.92 v67.94,81.92
  Bottom 0.203: v27.94,77.47 26.04,79.38 12.06,79.38 10.16,81.28 8.26,81.28 SIDE7.34 | v67.94,81.92 70.48,84.45 70.48,86.36 A3.U2
N$126  (via drill 0.61)
  Top 0.203: v40.64,80.01 53.34,80.01 55.88,82.55 66.67,82.55 67.31,83.19 A3.V2
  Bottom 0.203: v40.64,80.01 12.06,80.01 8.26,83.82 SIDE7.32
N$127  (via drill 0.61)
  Top 0.203: v19.05,97.79 19.05,109.86 20.32,111.12 SIDE8.10 | v66.67,148.59 76.83,138.43 A3.A1
  Bottom 0.203: v19.05,97.79 12.06,97.79 9.53,95.25 6.99,95.25 6.35,95.89 6.35,114.94 6.99,115.57 8.26,115.57 8.89,116.2 8.89,120.02 8.26,120.65 4.45,120.65 3.81,121.28 3.81,122.56 10.16,128.91 13.34,128.91 33.02,148.59 v66.67,148.59
N$128
  Top 0.203: SIDE8.6 20.32,117.47 27.94,125.09 27.94,137.16 32.38,141.6 64.14,141.6 70.48,135.25 73.66,135.25 A3.B1
N$129  (via drill 0.61)
  Top 0.203: v24.77,105.41 24.77,109.22 20.32,113.67 SIDE8.8 | v15.88,100.33 15.88,114.3 12.7,117.47 12.7,122.56 26.67,136.53 v26.67,143.51
  Bottom 0.203: v24.77,105.41 24.77,104.14 20.95,100.33 v15.88,100.33 | v26.67,143.51 33.02,149.86 67.94,149.86 74.3,143.51 74.3,137.16 72.39,135.25 72.39,133.35 73.66,132.08 73.66,128.91 A3.D1
N$130  (via drill 0.61)
  Top 0.203: v41.91,107.95 41.91,103.5 33.66,95.25 29.84,95.25 29.21,95.89 29.21,99.69 20.32,108.58 SIDE8.12 | v48.26,107.95 49.53,109.22 52.7,109.22 53.98,107.95 68.58,107.95 73.03,112.39 73.03,114.3 72.39,114.94 72.39,116.2 73.03,116.84 v75.56,116.84
  Bottom 0.203: v41.91,107.95 v48.26,107.95 | v75.56,116.84 76.83,115.57 78.11,115.57 79.38,116.84 80.01,116.84 81.28,118.11 81.28,119.38 80.01,120.65 79.38,120.65 77.47,122.56 77.47,124.46 A3.E1
N$131  (via drill 0.61)
  Top 0.203: v28.57,115.57 28.57,137.16 32.38,140.97 64.14,140.97 75.56,129.54 75.56,123.83 78.11,121.28 76.83,120.02 75.56,120.02 74.3,121.28 A3.F1
  Bottom 0.203: v28.57,115.57 20.32,107.31 SIDE8.14
N$132  (via drill 0.61)
  Top 0.203: v41.27,117.47 41.27,119.38 42.55,120.65 66.04,120.65 v67.31,119.38 | v69.85,116.84 72.39,116.84 73.03,117.47 74.93,117.47 76.83,119.38 A3.H1
  Bottom 0.203: v41.27,117.47 40.64,118.11 19.68,118.11 19.05,117.47 19.05,106.05 20.32,104.78 SIDE8.16 | v67.31,119.38 v69.85,116.84
N$133  (via drill 0.61)
  Top 0.203: v31.75,110.49 v38.73,110.49 | v49.53,107.95 53.34,107.95 53.98,107.31 68.58,107.31 73.66,112.39 73.66,114.94 A3.J1
  Bottom 0.203: v31.75,110.49 29.84,110.49 26.67,107.31 26.67,104.78 20.95,99.06 SIDE8.20 | v38.73,110.49 46.99,110.49 v49.53,107.95
N$134  (via drill 0.61)
  Top 0.203: v48.9,111.76 56.52,111.76 57.15,111.12 69.22,111.12 v69.85,110.49
  Bottom 0.203: v48.9,111.76 47.62,113.03 42.55,113.03 40.01,115.57 29.84,115.57 29.21,114.94 29.21,111.12 20.32,102.23 SIDE8.18 | v69.85,110.49 75.56,110.49 76.83,111.76 A3.K1
N$135  (via drill 0.61)
  Top 0.203: v40.64,93.98 42.55,93.98 44.45,95.89 44.45,99.69 45.09,100.33 53.34,100.33 58.42,95.25 62.23,95.25 73.66,106.68 73.66,108.58 A3.L1
  Bottom 0.203: v40.64,93.98 20.95,93.98 SIDE8.24
N$136  (via drill 0.61)
  Top 0.203: v62.23,67.94 63.5,66.67 65.41,66.67 75.56,76.83 v75.56,87
  Bottom 0.203: v62.23,67.94 60.96,69.22 57.15,69.22 52.7,73.66 52.7,81.28 45.09,88.9 20.95,88.9 SIDE8.28 | v75.56,87 75.56,104.14 76.83,105.41 A3.M1
N$137  (via drill 0.61)
  Top 0.203: v53.98,92.71 31.75,92.71 27.94,96.52 20.95,96.52 SIDE8.22 | v55.88,94.61 62.23,94.61 69.85,102.23 73.66,102.23 A3.N1
  Bottom 0.203: v53.98,92.71 v55.88,94.61
N$138  (via drill 0.61)
  Top 0.203: v50.16,71.75 58.42,71.75 59.05,71.12 61.59,71.12 71.75,81.28 71.75,84.45 78.74,91.44 78.74,95.25 77.47,96.52 77.47,99.06 A3.P1
  Bottom 0.203: v50.16,71.75 35.56,86.36 20.95,86.36 SIDE8.30
N$139  (via drill 0.61)
  Top 0.203: v67.31,88.27 69.85,85.72 v71.75,85.72
  Bottom 0.203: v67.31,88.27 67.31,87.63 64.14,84.45 62.87,84.45 62.23,85.09 59.05,85.09 56.52,82.55 52.7,82.55 43.81,91.44 20.95,91.44 SIDE8.26 | v71.75,85.72 72.39,86.36 72.39,94.61 73.66,95.89 A3.R1
N$140  (via drill 0.61)
  Top 0.203: v66.04,84.45 62.87,84.45 61.59,85.72 33.66,85.72 31.75,83.82 20.95,83.82 SIDE8.32 | v69.22,87.63 69.85,88.27 74.93,88.27 76.83,90.17 76.83,92.71 A3.S1
  Bottom 0.203: v66.04,84.45 v69.22,87.63
N$141  (via drill 0.61)
  Top 0.203: v56.52,89.53 56.52,90.81 55.88,91.44 53.98,91.44 52.7,90.17 19.68,90.17 19.05,89.53 19.05,83.19 20.32,81.92 SIDE8.34 | v62.87,85.72 62.87,87.63 66.67,91.44 73.03,91.44 73.66,90.81 A3.T1
  Bottom 0.203: v56.52,89.53 55.88,88.9 53.98,88.9 53.34,89.53 52.07,88.27 54.61,85.72 v62.87,85.72
N$142  (via drill 0.61)
  Top 0.203: v28.57,106.68 28.57,107.95 20.95,115.57 19.68,115.57 19.05,116.2 19.05,117.47 20.32,118.75 SIDE8.4 | v57.78,89.53 59.69,89.53 60.33,88.9 62.23,88.9 v72.39,99.06
  Bottom 0.203: v28.57,106.68 29.84,105.41 33.66,105.41 41.91,97.16 41.91,95.89 46.35,91.44 55.88,91.44 v57.78,89.53 | v72.39,99.06 72.39,103.5 76.2,107.31 78.11,107.31 78.74,106.68 78.74,91.44 77.47,90.17 77.47,87.63 A3.U1
N$143  (via drill 0.61)
  Top 0.203: v71.75,113.67 68.58,116.84 68.58,118.11 v69.22,118.75 | v69.22,121.28 68.58,120.65 66.67,120.65 v64.14,123.19 | v26.04,128.27 20.32,122.56 SIDE8.2
  Bottom 0.203: v71.75,113.67 78.11,113.67 81.92,109.86 81.92,102.23 81.28,101.6 81.28,99.06 81.92,98.42 81.92,95.89 81.28,95.25 81.28,93.34 78.74,90.81 78.74,86.36 76.83,84.45 74.3,84.45 A3.V1 | v69.22,121.28 v69.22,118.75 | v64.14,123.19 56.52,123.19 55.24,124.46 50.8,124.46 48.9,126.36 48.9,127 47.62,128.27 v26.04,128.27
N$144  (via drill 0.61)
  Top 0.203: SIDE8.1 17.78,121.28 17.78,120.02 SIDE8.3 17.78,118.75 17.78,117.47 SIDE8.5 17.78,116.2 17.78,114.94 SIDE8.7 17.78,113.67 17.78,112.39 SIDE8.9 17.78,111.12 17.78,109.86 SIDE8.11 17.78,108.58 17.78,107.31 SIDE8.13 17.78,106.05 17.78,104.78 SIDE8.15 17.78,103.5 17.78,102.23 SIDE8.17 17.78,100.97 17.78,99.69 SIDE8.19 17.78,98.42 17.78,97.16 SIDE8.21 17.78,95.89 17.78,94.61 SIDE8.23 17.78,93.34 17.78,92.08 SIDE8.25 17.78,90.81 17.78,89.53 SIDE8.27 17.78,88.27 17.78,87 SIDE8.29 17.78,85.72 17.78,84.45 SIDE8.31 17.78,83.19 17.78,81.92 SIDE8.33 17.78,80.64 v20.32,78.11 | v27.3,147.32 36.83,147.32 38.1,148.59 64.14,148.59 76.83,135.89 76.83,132.08 A3.C1
  Bottom 0.203: v27.3,147.32 26.04,147.32 2.54,123.83 2.54,81.92 6.35,78.11 v20.32,78.11
N$145  (via drill 0.61)
  Top 0.203: SIDE9.33 30.48,97.16 30.48,98.42 SIDE9.31 30.48,99.69 30.48,100.97 SIDE9.29 30.48,102.23 30.48,103.5 SIDE9.27 30.48,104.78 30.48,106.05 SIDE9.25 30.48,107.31 30.48,108.58 SIDE9.23 30.48,109.86 30.48,111.12 SIDE9.21 30.48,112.39 30.48,113.67 SIDE9.19 30.48,114.94 30.48,116.2 SIDE9.17 30.48,117.47 30.48,118.75 SIDE9.15 30.48,120.02 30.48,121.28 SIDE9.13 30.48,122.56 30.48,123.83 SIDE9.11 30.48,125.09 30.48,126.36 SIDE9.9 30.48,127.64 30.48,128.91 SIDE9.7 30.48,130.18 30.48,131.44 SIDE9.5 30.48,132.72 30.48,133.99 SIDE9.3 30.48,135.25 30.48,136.53 SIDE9.1 31.11,137.16 33.02,139.06 46.99,139.06 v48.9,137.16
  Bottom 0.203: v48.9,137.16 53.98,132.08 57.78,132.08 A4.C2
N$146
  Bottom 0.203: SIDE9.2 33.66,137.16 40.64,137.16 43.81,140.34 55.88,140.34 57.78,138.43 A4.A2
N$147
  Top 0.203: SIDE9.4 33.66,134.62 38.73,134.62 42.55,138.43 46.35,138.43 49.53,135.25 54.61,135.25 A4.B2
N$148
  Bottom 0.203: A4.D2 54.61,128.91 47.62,135.89 40.64,135.89 36.83,132.08 33.66,132.08 SIDE9.6
N$149  (via drill 0.61)
  Top 0.203: v49.53,128.27 52.07,125.73 57.78,125.73 A4.E2 | v39.37,133.35 37.47,133.35 33.66,129.54 SIDE9.8
  Bottom 0.203: v49.53,128.27 49.53,130.18 46.35,133.35 v39.37,133.35
N$150
  Bottom 0.203: A4.F2 54.61,122.56 49.53,122.56 46.35,125.73 34.92,125.73 33.66,127 SIDE9.10
N$151
  Bottom 0.203: A4.H2 57.78,119.38 50.16,119.38 46.35,123.19 34.92,123.19 33.66,124.46 SIDE9.12
N$152
  Bottom 0.203: A4.J2 54.61,116.2 50.8,116.2 46.35,120.65 42.55,120.65 41.27,121.92 33.66,121.92 SIDE9.14
N$153
  Bottom 0.203: A4.K2 57.78,113.03 51.44,113.03 46.35,118.11 42.55,118.11 40.01,120.65 34.92,120.65 33.66,119.38 SIDE9.16
N$154
  Bottom 0.203: A4.L2 54.61,109.86 52.07,109.86 46.35,115.57 40.64,115.57 39.37,116.84 33.66,116.84 SIDE9.18
N$155  (via drill 0.61)
  Top 0.203: v53.34,105.41 57.78,105.41 A4.M2
  Bottom 0.203: v53.34,105.41 42.55,105.41 33.66,114.3 SIDE9.20
N$156
  Bottom 0.203: SIDE9.22 33.66,111.76 42.55,102.87 54.61,102.87 A4.N2
N$157  (via drill 0.61)
  Top 0.203: v41.27,101.6 42.55,102.87 52.7,102.87 55.24,100.33 57.78,100.33 A4.P2
  Bottom 0.203: v41.27,101.6 33.66,109.22 SIDE9.24
N$158
  Bottom 0.203: SIDE9.26 33.66,106.68 42.55,97.79 53.98,97.79 54.61,97.16 A4.R2
N$159
  Bottom 0.203: A4.S2 57.78,93.98 57.78,95.89 53.34,100.33 41.27,100.33 33.66,107.95 28.57,107.95 27.3,106.68 27.3,105.41 29.84,102.87 31.11,102.87 32.38,104.14 SIDE9.28
N$160
  Bottom 0.203: SIDE9.30 33.66,101.6 35.56,101.6 46.35,90.81 54.61,90.81 A4.T2
N$161  (via drill 0.61)
  Top 0.203: v50.8,87 57.78,87 A4.U2
  Bottom 0.203: v50.8,87 50.16,87.63 48.26,87.63 39.37,96.52 33.66,96.52 SIDE9.34
N$162
  Bottom 0.203: SIDE9.32 33.66,99.06 37.47,99.06 47.62,88.9 50.16,88.9 54.61,84.45 A4.V2
N$163  (via drill 0.61)
  Top 0.203: v50.8,125.73 47.62,125.73 46.35,127 SIDE10.10 | v50.8,131.44 55.88,131.44 61.59,137.16 64.14,137.16 A4.A1
  Bottom 0.203: v50.8,125.73 v50.8,131.44
N$164  (via drill 0.61)